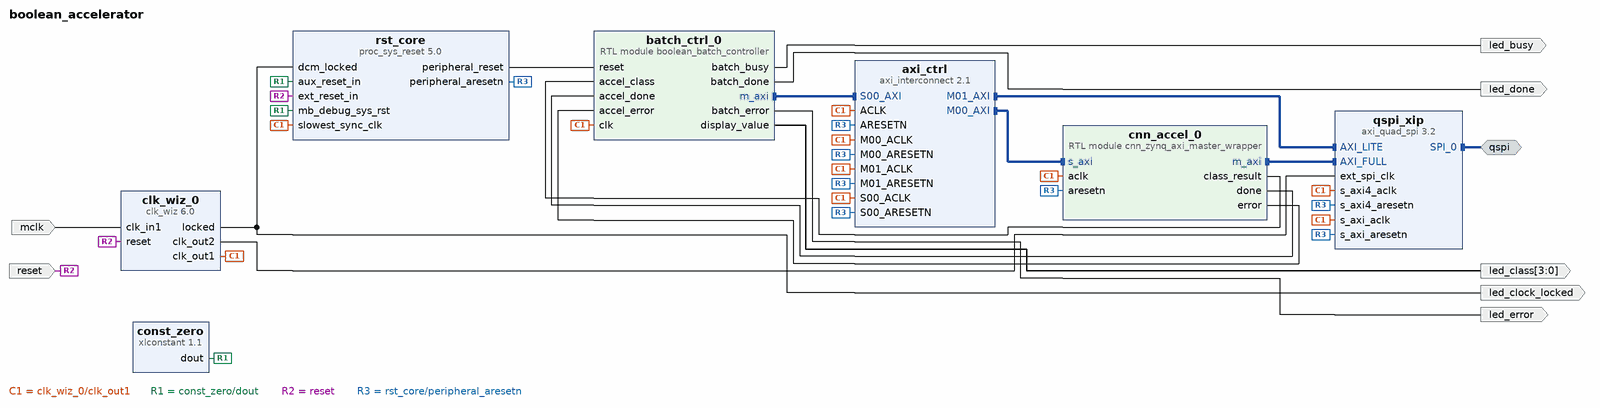
[diagram p0: block diagram of the top level]
# Vivado block design boolean_accelerator, xc7s50csga324-1, Vivado 2025.2
create_bd_design boolean_accelerator

create_bd_intf_port -mode Master -vlnv xilinx.com:interface:spi_rtl:1.0 qspi
create_bd_port -dir I -type clk mclk
create_bd_port -dir I -type rst reset
set_property -dict {CONFIG.POLARITY ACTIVE_HIGH} [get_bd_ports reset]
create_bd_port -dir O -from 3 -to 0 led_class
create_bd_port -dir O led_busy
create_bd_port -dir O led_done
create_bd_port -dir O led_error
create_bd_port -dir O led_clock_locked

create_bd_cell -type ip -vlnv xilinx.com:ip:clk_wiz:6.0 clk_wiz_0
set_property -dict [list \
  CONFIG.CLKOUT1_REQUESTED_OUT_FREQ 5.000 \
  CONFIG.CLKOUT2_REQUESTED_OUT_FREQ 50.000 \
  CONFIG.CLKOUT2_USED true \
  CONFIG.NUM_OUT_CLKS 2 \
  CONFIG.PRIM_IN_FREQ 100.000 \
  CONFIG.PRIM_SOURCE Single_ended_clock_capable_pin \
  CONFIG.RESET_TYPE ACTIVE_HIGH \
  CONFIG.USE_LOCKED true \
  CONFIG.USE_RESET true \
] [get_bd_cells clk_wiz_0]
create_bd_cell -type ip -vlnv xilinx.com:ip:proc_sys_reset:5.0 rst_core
create_bd_cell -type ip -vlnv xilinx.com:ip:xlconstant:1.1 const_zero
set_property -dict {CONFIG.CONST_VAL 0} [get_bd_cells const_zero]
create_bd_cell -type module -reference boolean_batch_controller batch_ctrl_0
set_property -dict [list \
  CONFIG.CONTROL_BASE {"10000000000000000000000000000000"} \
  CONFIG.IMAGE_BASE {"00000000101101101000011111001100"} \
  CONFIG.IMAGE_BYTES 784 \
  CONFIG.IMAGE_COUNT 10 \
] [get_bd_cells batch_ctrl_0]
create_bd_cell -type ip -vlnv xilinx.com:ip:axi_interconnect:2.1 axi_ctrl
set_property -dict {CONFIG.NUM_MI 2 CONFIG.NUM_SI 1} [get_bd_cells axi_ctrl]
create_bd_cell -type ip -vlnv xilinx.com:ip:axi_quad_spi:3.2 qspi_xip
set_property -dict [list \
  CONFIG.C_SPI_MEMORY 3 \
  CONFIG.C_SPI_MEM_ADDR_BITS 24 \
  CONFIG.C_SPI_MODE 2 \
  CONFIG.C_USE_STARTUP 1 \
  CONFIG.C_XIP_MODE 1 \
  CONFIG.C_XIP_PERF_MODE 1 \
] [get_bd_cells qspi_xip]
create_bd_cell -type module -reference cnn_zynq_axi_master_wrapper cnn_accel_0
set_property -dict [list \
  CONFIG.CLASS_W 4 \
  CONFIG.C_M_AXI_ADDR_WIDTH 24 \
  CONFIG.C_M_AXI_DATA_WIDTH 32 \
  CONFIG.C_M_AXI_ID_WIDTH 1 \
  CONFIG.DEFAULT_BIAS_BASE {"00000000101101100111110001000000"} \
  CONFIG.DEFAULT_IMAGE_BASE {"00000000101101101000011111001100"} \
  CONFIG.DEFAULT_WEIGHT_BASE {"00000000010000000000000000000000"} \
  CONFIG.USE_QUIRE 1 \
] [get_bd_cells cnn_accel_0]

# ---- connections ----

connect_bd_intf_net [get_bd_intf_pins axi_ctrl/M00_AXI] [get_bd_intf_pins cnn_accel_0/s_axi]
connect_bd_intf_net [get_bd_intf_pins axi_ctrl/M01_AXI] [get_bd_intf_pins qspi_xip/AXI_LITE]
connect_bd_intf_net [get_bd_intf_pins batch_ctrl_0/m_axi] [get_bd_intf_pins axi_ctrl/S00_AXI]
connect_bd_intf_net [get_bd_intf_pins cnn_accel_0/m_axi] [get_bd_intf_pins qspi_xip/AXI_FULL]
connect_bd_intf_net [get_bd_intf_ports qspi] [get_bd_intf_pins qspi_xip/SPI_0]
connect_bd_net [get_bd_pins batch_ctrl_0/batch_busy] [get_bd_ports led_busy]
connect_bd_net [get_bd_pins batch_ctrl_0/batch_done] [get_bd_ports led_done]
connect_bd_net [get_bd_pins batch_ctrl_0/batch_error] [get_bd_ports led_error]
connect_bd_net [get_bd_pins batch_ctrl_0/display_value] [get_bd_ports led_class]
connect_bd_net -net clk_in1_0_1 [get_bd_ports mclk] [get_bd_pins clk_wiz_0/clk_in1]
connect_bd_net [get_bd_pins clk_wiz_0/clk_out1] \
  [get_bd_pins rst_core/slowest_sync_clk] [get_bd_pins batch_ctrl_0/clk] [get_bd_pins axi_ctrl/ACLK] \
  [get_bd_pins axi_ctrl/S00_ACLK] [get_bd_pins axi_ctrl/M00_ACLK] [get_bd_pins axi_ctrl/M01_ACLK] \
  [get_bd_pins qspi_xip/s_axi_aclk] [get_bd_pins qspi_xip/s_axi4_aclk] [get_bd_pins cnn_accel_0/aclk]
connect_bd_net [get_bd_pins clk_wiz_0/clk_out2] [get_bd_pins qspi_xip/ext_spi_clk]
connect_bd_net [get_bd_pins clk_wiz_0/locked] [get_bd_pins rst_core/dcm_locked] [get_bd_ports led_clock_locked]
connect_bd_net [get_bd_pins cnn_accel_0/class_result] [get_bd_pins batch_ctrl_0/accel_class]
connect_bd_net [get_bd_pins cnn_accel_0/done] [get_bd_pins batch_ctrl_0/accel_done]
connect_bd_net [get_bd_pins cnn_accel_0/error] [get_bd_pins batch_ctrl_0/accel_error]
connect_bd_net [get_bd_pins const_zero/dout] [get_bd_pins rst_core/aux_reset_in] [get_bd_pins rst_core/mb_debug_sys_rst]
connect_bd_net [get_bd_ports reset] [get_bd_pins clk_wiz_0/reset] [get_bd_pins rst_core/ext_reset_in]
connect_bd_net [get_bd_pins rst_core/peripheral_aresetn] \
  [get_bd_pins axi_ctrl/ARESETN] [get_bd_pins axi_ctrl/S00_ARESETN] [get_bd_pins axi_ctrl/M00_ARESETN] \
  [get_bd_pins axi_ctrl/M01_ARESETN] [get_bd_pins qspi_xip/s_axi_aresetn] [get_bd_pins qspi_xip/s_axi4_aresetn] \
  [get_bd_pins cnn_accel_0/aresetn]
connect_bd_net [get_bd_pins rst_core/peripheral_reset] [get_bd_pins batch_ctrl_0/reset]

# ---- address map ----
assign_bd_address -offset 0x44A00000 -range 4K -target_address_space [get_bd_addr_spaces batch_ctrl_0/m_axi] [get_bd_addr_segs qspi_xip/AXI_LITE/Reg]
assign_bd_address -offset 0x80000000 -range 4K -target_address_space [get_bd_addr_spaces batch_ctrl_0/m_axi] [get_bd_addr_segs cnn_accel_0/s_axi/reg0]
assign_bd_address -offset 0x000000 -range 16M -target_address_space [get_bd_addr_spaces cnn_accel_0/m_axi] [get_bd_addr_segs qspi_xip/aximm/MEM0]

validate_bd_design
save_bd_design
